# Altium schematic sheet Sensor00.SchDoc
size A4 portrait
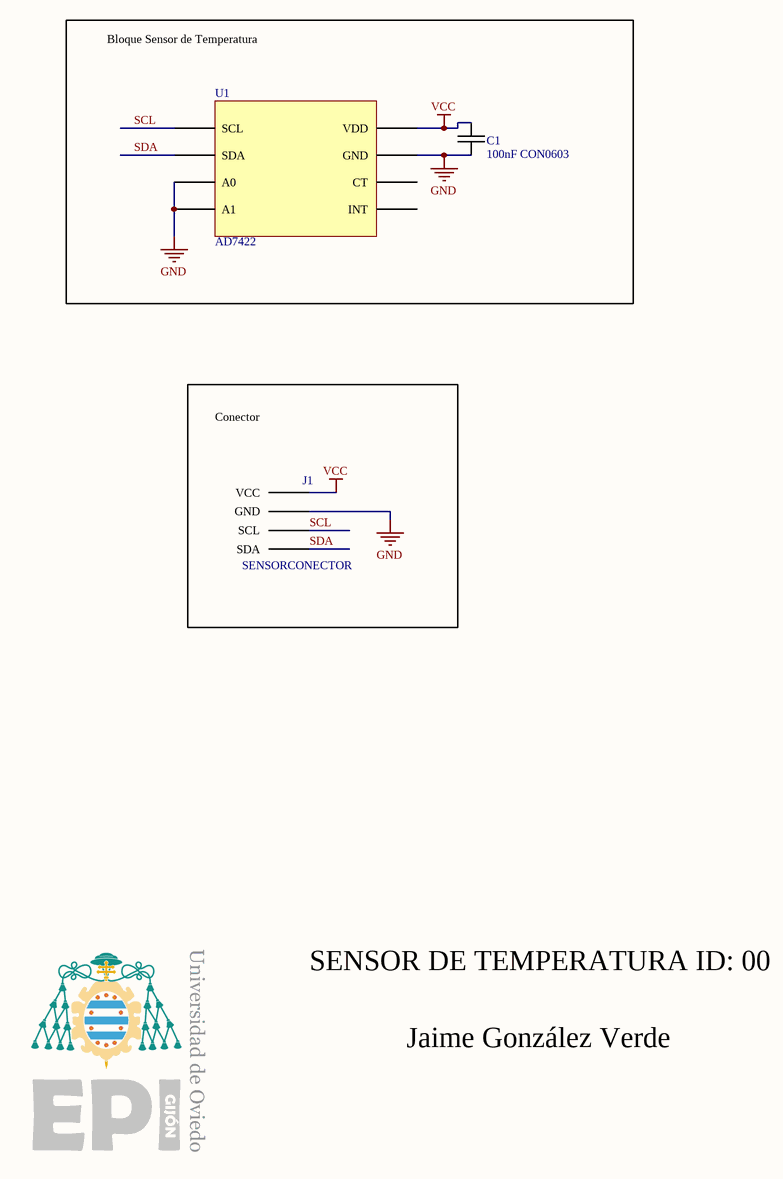
[diagram p0: Sensor00.SchDoc]

## Parts
C1  100nF CON0603  [CAPC0603X06N]
J1  SENSORCONECTOR  [ConectorSMD1,3mm]
U1  AD7422  [ADT7422]

## Blocks framed on the sheet
Bloque Sensor de Temperatura: C1 U1
Conector: J1

## Nets
GND: C1.2 J1.2(GND) U1.3(A0) U1.4(A1) U1.11(GND)
VCC: C1.1 J1.3(VCC) U1.12(VDD)
SCL: J1.1(SCL) U1.1(SCL)
SDA: J1.0(SDA) U1.2(SDA)

Not connected (* = marked no-connect by the designer): U1 9(INT) 10(CT)

## Notes on the sheet
- SENSOR DE TEMPERATURA ID: 00
- Jaime González Verde

## Library data of the parts
C1 = CON0603